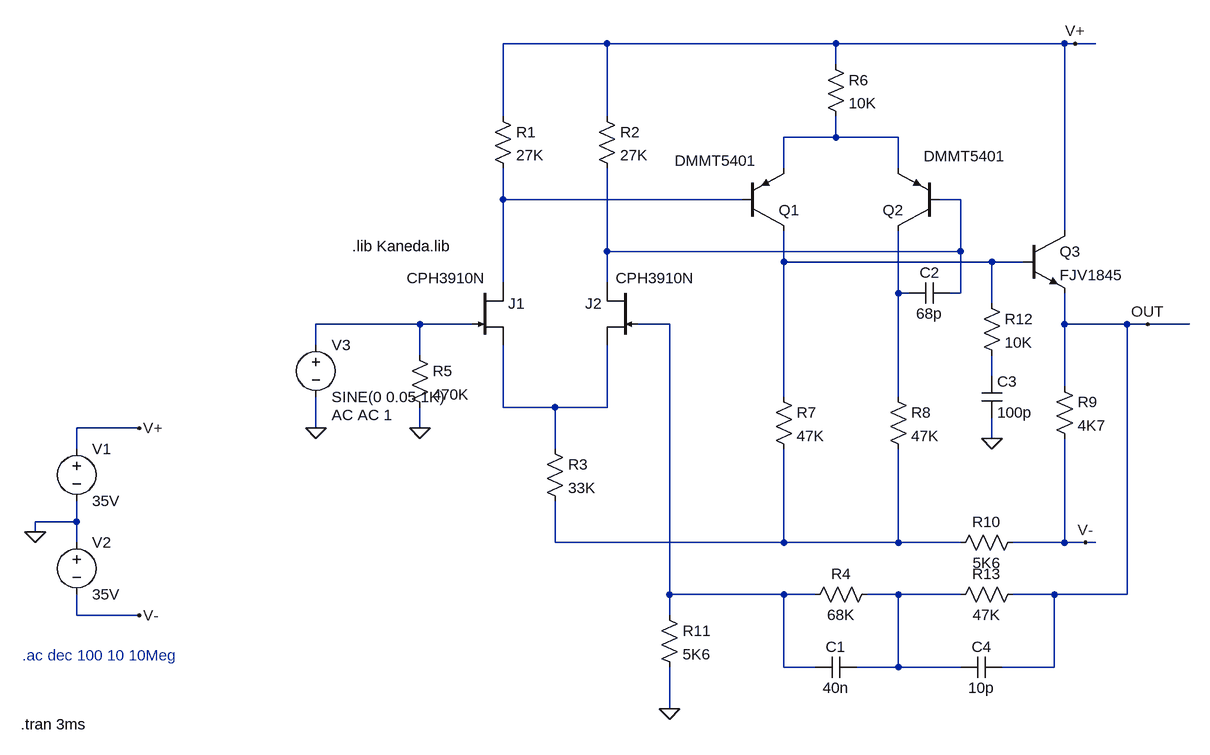
[diagram p0: schematic Kaneda.asc]
Kaneda.asc, the LTspice schematic file:
Version 4
SHEET 1 1172 840
WIRE 272 -224 112 -224
WIRE 624 -224 272 -224
WIRE 976 -224 624 -224
WIRE 992 -224 976 -224
WIRE 1024 -224 992 -224
WIRE 624 -192 624 -224
WIRE 112 -112 112 -224
WIRE 272 -112 272 -224
WIRE 624 -80 624 -112
WIRE 624 -80 544 -80
WIRE 720 -80 624 -80
WIRE 544 -32 544 -80
WIRE 720 -32 720 -80
WIRE 112 16 112 -32
WIRE 480 16 112 16
WIRE 816 16 784 16
WIRE 976 64 976 -224
WIRE 272 96 272 -32
WIRE 816 96 816 16
WIRE 816 96 272 96
WIRE 544 112 544 64
WIRE 864 112 544 112
WIRE 912 112 864 112
WIRE 112 144 112 16
WIRE 272 144 272 96
WIRE 720 160 720 64
WIRE 736 160 720 160
WIRE 816 160 816 96
WIRE 816 160 800 160
WIRE 864 176 864 112
WIRE -16 208 -176 208
WIRE 64 208 -16 208
WIRE 368 208 320 208
WIRE 976 208 976 160
WIRE 1072 208 976 208
WIRE 1104 208 1072 208
WIRE 1168 208 1104 208
WIRE -176 240 -176 208
WIRE -16 256 -16 208
WIRE 864 288 864 256
WIRE 976 304 976 208
WIRE 544 320 544 112
WIRE 720 320 720 160
WIRE 112 336 112 240
WIRE 192 336 112 336
WIRE 272 336 272 240
WIRE 272 336 192 336
WIRE -448 368 -544 368
WIRE -176 368 -176 320
WIRE -16 368 -16 336
WIRE 864 384 864 352
WIRE -544 400 -544 368
WIRE 192 400 192 336
WIRE -544 512 -544 480
WIRE -544 512 -608 512
WIRE -608 528 -608 512
WIRE -544 544 -544 512
WIRE 192 544 192 480
WIRE 544 544 544 400
WIRE 544 544 192 544
WIRE 720 544 720 400
WIRE 720 544 544 544
WIRE 816 544 720 544
WIRE 976 544 976 384
WIRE 976 544 896 544
WIRE 1008 544 976 544
WIRE 1024 544 1008 544
WIRE 368 624 368 208
WIRE 544 624 368 624
WIRE 592 624 544 624
WIRE 720 624 672 624
WIRE 816 624 720 624
WIRE 960 624 896 624
WIRE 1072 624 1072 208
WIRE 1072 624 960 624
WIRE -544 656 -544 624
WIRE -448 656 -544 656
WIRE 368 656 368 624
WIRE 544 736 544 624
WIRE 592 736 544 736
WIRE 720 736 720 624
WIRE 720 736 656 736
WIRE 816 736 720 736
WIRE 960 736 960 624
WIRE 960 736 880 736
WIRE 368 800 368 736
FLAG -608 528 0
FLAG -448 368 V+
FLAG -448 656 V-
FLAG 992 -224 V+
FLAG 1008 544 V-
FLAG -16 368 0
FLAG 368 800 0
FLAG -176 368 0
FLAG 1104 208 OUT
FLAG 864 384 0
SYMBOL njf 64 144 R0
WINDOW 3 -100 -7 Left 2
SYMATTR InstName J1
SYMATTR Value CPH3910N
SYMBOL njf 320 144 M0
WINDOW 3 -87 -7 Left 2
SYMATTR InstName J2
SYMATTR Value CPH3910N
SYMBOL res 96 -128 R0
SYMATTR InstName R1
SYMATTR Value 27K
SYMBOL res 256 -128 R0
SYMATTR InstName R2
SYMATTR Value 27K
SYMBOL res 176 384 R0
SYMATTR InstName R3
SYMATTR Value 33K
SYMBOL voltage -544 384 R0
WINDOW 123 0 0 Left 0
WINDOW 39 0 0 Left 0
SYMATTR InstName V1
SYMATTR Value 35V
SYMBOL voltage -544 528 R0
WINDOW 123 0 0 Left 0
WINDOW 39 0 0 Left 0
SYMATTR InstName V2
SYMATTR Value 35V
SYMBOL res -32 240 R0
SYMATTR InstName R5
SYMATTR Value 470K
SYMBOL pnp 480 64 M180
WINDOW 3 -104 108 Left 2
SYMATTR InstName Q1
SYMATTR Value DMMT5401
SYMBOL pnp 784 64 R180
WINDOW 3 -102 115 Left 2
SYMATTR InstName Q2
SYMATTR Value DMMT5401
SYMBOL npn 912 64 R0
SYMATTR InstName Q3
SYMATTR Value FJV1845
SYMBOL res 608 -208 R0
SYMATTR InstName R6
SYMATTR Value 10K
SYMBOL res 528 304 R0
SYMATTR InstName R7
SYMATTR Value 47K
SYMBOL res 704 304 R0
SYMATTR InstName R8
SYMATTR Value 47K
SYMBOL res 960 288 R0
SYMATTR InstName R9
SYMATTR Value 4K7
SYMBOL res 912 528 R90
WINDOW 0 0 56 VBottom 2
WINDOW 3 32 56 VTop 2
SYMATTR InstName R10
SYMATTR Value 5K6
SYMBOL res 688 608 R90
WINDOW 0 0 56 VBottom 2
WINDOW 3 32 56 VTop 2
SYMATTR InstName R4
SYMATTR Value 68K
SYMBOL res 352 640 R0
SYMATTR InstName R11
SYMATTR Value 5K6
SYMBOL voltage -176 224 R0
WINDOW 123 24 124 Left 2
WINDOW 39 0 0 Left 0
SYMATTR InstName V3
SYMATTR Value SINE(0 0.05 1K)
SYMATTR Value2 AC AC 1
SYMBOL cap 656 720 R90
WINDOW 0 0 32 VBottom 2
WINDOW 3 32 32 VTop 2
SYMATTR InstName C1
SYMATTR Value 40n
SYMBOL cap 800 144 R90
WINDOW 0 0 32 VBottom 2
WINDOW 3 32 32 VTop 2
SYMATTR InstName C2
SYMATTR Value 68p
SYMBOL res 848 160 R0
SYMATTR InstName R12
SYMATTR Value 10K
SYMBOL cap 848 288 R0
SYMATTR InstName C3
SYMATTR Value 100p
SYMBOL res 912 608 R90
WINDOW 0 0 56 VBottom 2
WINDOW 3 32 56 VTop 2
SYMATTR InstName R13
SYMATTR Value 47K
SYMBOL cap 880 720 R90
WINDOW 0 0 32 VBottom 2
WINDOW 3 32 32 VTop 2
SYMATTR InstName C4
SYMATTR Value 10p
TEXT -628 718 Left 2 ;.ac dec 100 10 10Meg
TEXT -120 88 Left 2 !.lib Kaneda.lib
TEXT -630 824 Left 2 !.tran 3ms

The netlist it stands for:
* Kaneda.asc
J1 N002 N006 N009 CPH3910N
J2 N003 N007 N009 CPH3910N
R1 V+ N002 27K
R2 V+ N003 27K
R3 N009 N010 33K
V1 V+ 0 35V
V2 0 V- 35V
R5 N006 0 470K
Q1 N004 N002 N001 0 DMMT5401
Q2 N005 N003 N001 0 DMMT5401
Q3 V+ N004 OUT 0 FJV1845
R6 V+ N001 10K
R7 N004 N010 47K
R8 N005 N010 47K
R9 OUT V- 4K7
R10 V- N010 5K6
R4 N011 N007 68K
R11 N007 0 5K6
V3 N006 0 SINE(0 0.05 1K) AC AC 1
C1 N011 N007 40n
C2 N003 N005 68p
R12 N004 N008 10K
C3 N008 0 100p
R13 OUT N011 47K
C4 OUT N011 10p
.model NPN NPN
.model PNP PNP
.lib standard.bjt
.model NJF NJF
.model PJF PJF
.lib standard.jft
* .ac dec 100 10 10Meg
.lib Kaneda.lib
.tran 3ms
.backanno
.end